# EAGLE design mini48U-v0.6.1 (EAGLE 5.11)
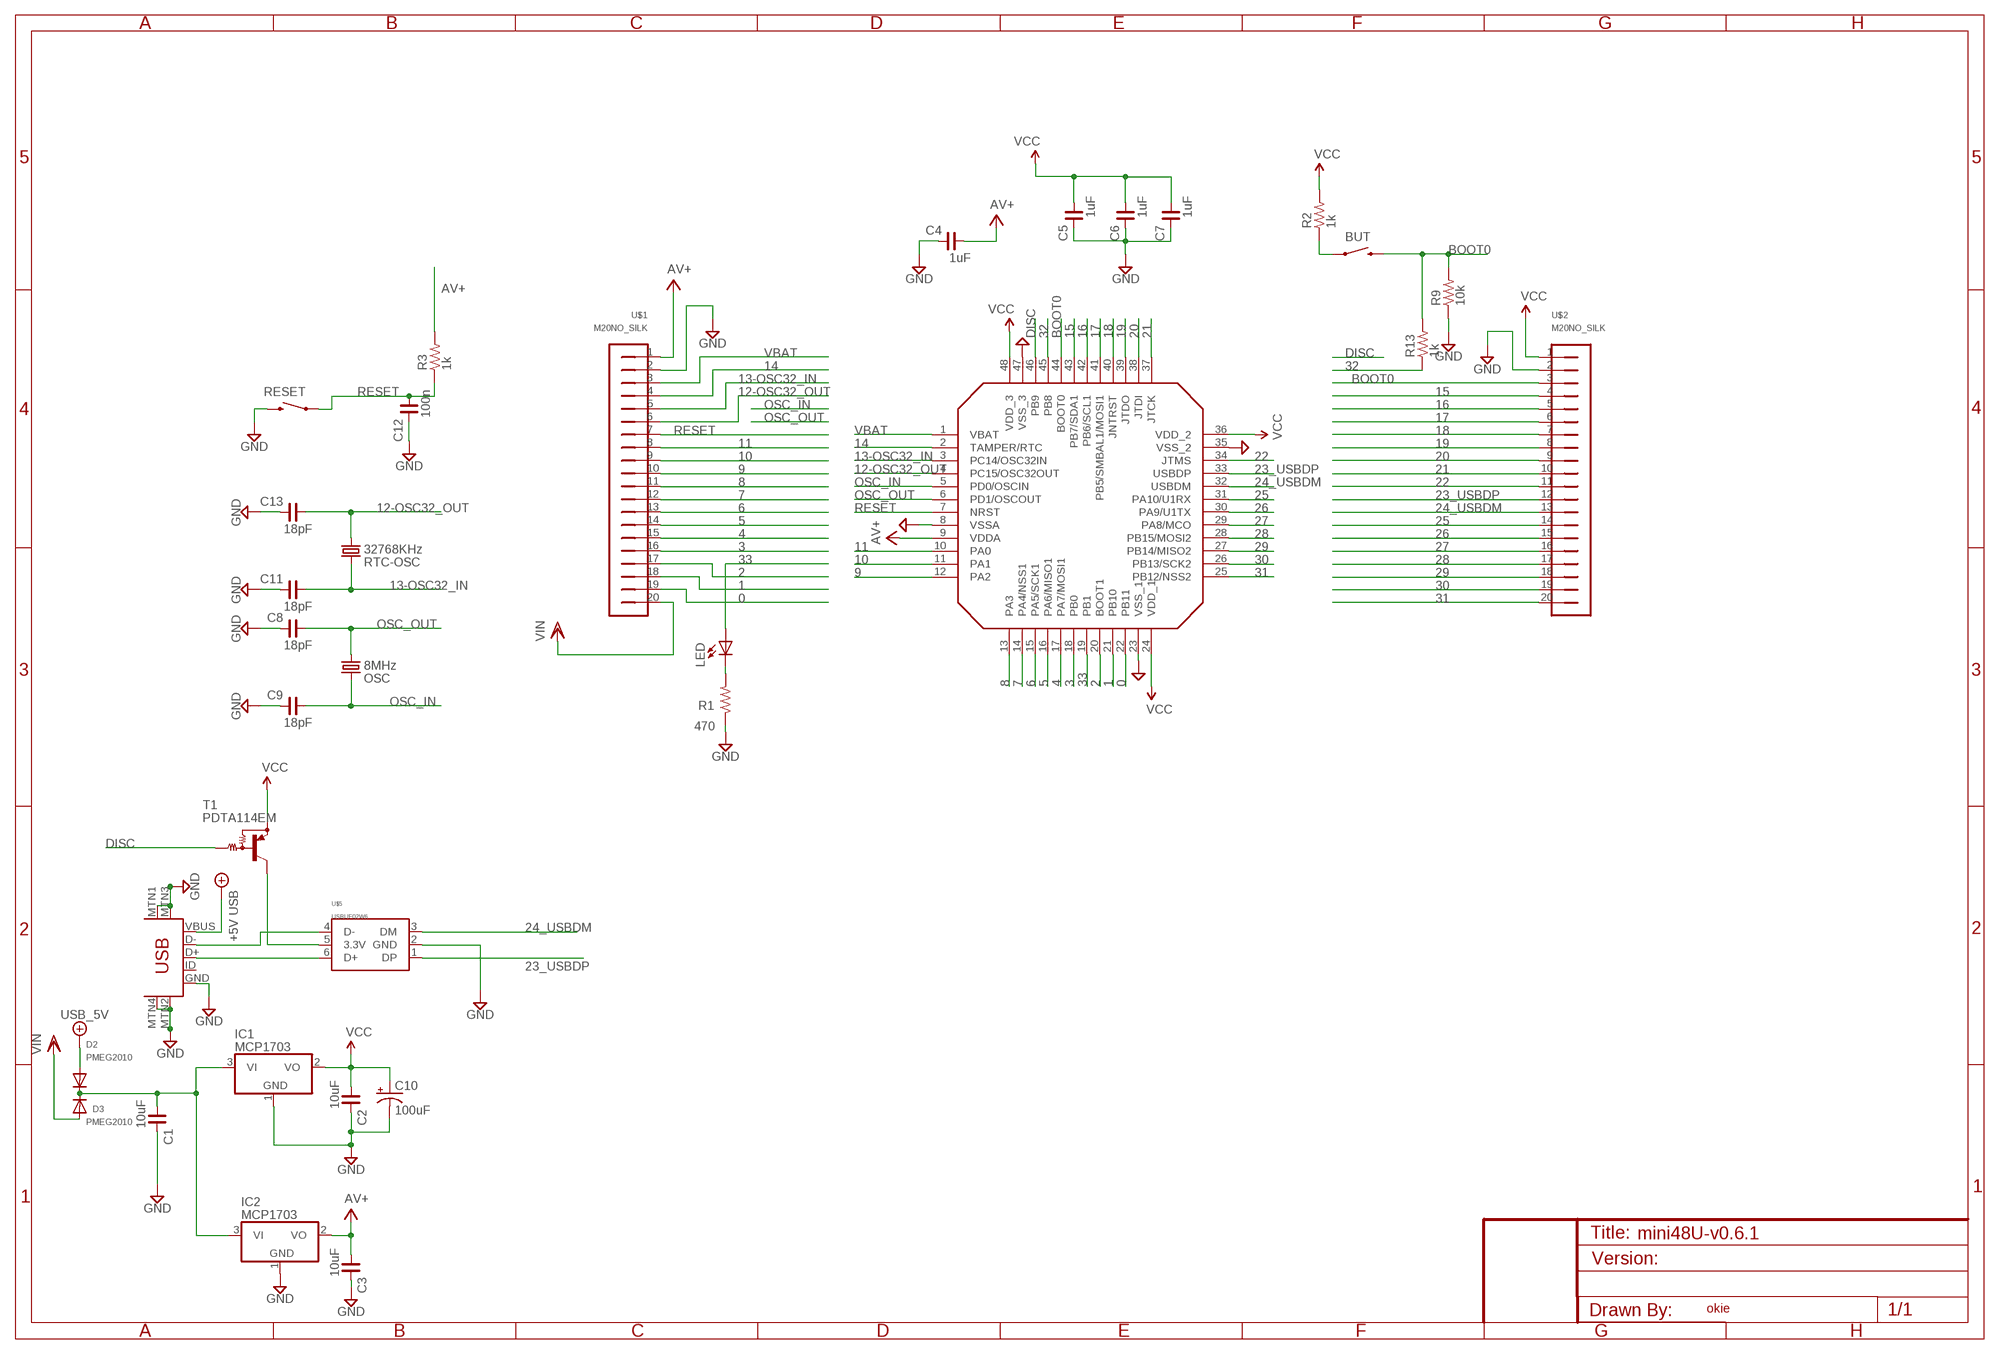
[diagram p0: schematic, sheet 1]

## Parts
BUT  SWITCH-MOMENTARY-2-SMD-1101NE  [TACTILE-SWITCH-1101NE]
C1  10uF  C_0805  [C0805]
C2  10uF  C_0805  [C0805]
C3  10uF  C_0805  [C0805]
C4  1uF  C_0402  [C0402]
C5  1uF  C_0402  [C0402]
C6  1uF  C_0402  [C0402]
C7  1uF  C_0402  [C0402]
C8  18pF  C_0402  [C0402]
C9  18pF  C_0402  [C0402]
C10  100uF  CAP_POL3528  [EIA3528]
C11  18pF  C_0402  [C0402]
C12  100n  C_0402  [C0402]
C13  18pF  C_0402  [C0402]
D2  PMEG2010  DIODESOD-323  [SOD-323]
D3  PMEG2010  DIODESOD-323  [SOD-323]
IC1  MCP1703  [SOT23-3]
IC2  MCP1703  [SOT23-3]
LED  LED  LEDKA-3528ASYC  [KA-3528ASYC]
OSC  8MHz  CRYSTALTC38H  [TC38H]
R1  470  R_0402  [R0402]
R2  1k  R_0402  [R0402]
R3  1k  R_0402  [R0402]
R9  10k  R_0402  [R0402]
R13  1k  R_0402  [R0402]
RESET  SWITCH-MOMENTARY-2-SMD-1101NE  [TACTILE-SWITCH-1101NE]
RTC-OSC  32768KHz  CRYSTALTC26H  [TC26H]
T1  PDTA114EM  PNP-DRIVERSOT723  [SOT-723]
U$1  M20NO_SILK  [1X20_NO_SILK]
U$2  M20NO_SILK  [1X20_NO_SILK]
U$4  STM32F103_48  [LQFP48-7X7]
U$5  USBUF02W6  [SC70-6]
USB  USB-MINIB-5PIN  [USB-MINIB]

## Nets
0: U$1.19 U$4.22(PB11)
1: U$1.18 U$4.21(PB10)
2: U$1.17 U$4.20(BOOT1)
3: U$1.16 U$4.18(PB0)
4: U$1.15 U$4.17(PA7/MOSI1)
5: U$1.14 U$4.16(PA6/MISO1)
6: U$1.13 U$4.15(PA5/SCK1)
7: U$1.12 U$4.14(PA4/NSS1)
8: U$1.11 U$4.13(PA3)
9: U$1.10 U$4.12(PA2)
10: U$1.9 U$4.11(PA1)
11: U$1.8 U$4.10(PA0)
12-OSC32_OUT: C13.1 RTC-OSC.1 U$1.6 U$4.4(PC15/OSC32OUT)
13-OSC32_IN: C11.1 RTC-OSC.2 U$1.5 U$4.3(PC14/OSC32IN)
14: U$1.4 U$4.2(TAMPER/RTC)
15: U$2.4 U$4.43(PB7/SDA1)
16: U$2.5 U$4.42(PB6/SCL1)
17: U$2.6 U$4.41(PB5/SMBAL1/MOSI1)
18: U$2.7 U$4.40(JNTRST)
19: U$2.8 U$4.39(JTDO)
20: U$2.9 U$4.38(JTDI)
21: U$2.10 U$4.37(JTCK)
22: U$2.11 U$4.34(JTMS)
23_USBDP: U$2.12 U$4.33(USBDP) U$5.1(DP)
24_USBDM: U$2.13 U$4.32(USBDM) U$5.3(DM)
25: U$2.14 U$4.31(PA10/U1RX)
26: U$2.15 U$4.30(PA9/U1TX)
27: U$2.16 U$4.29(PA8/MCO)
28: U$2.17 U$4.28(PB15/MOSI2)
29: U$2.18 U$4.27(PB14/MISO2)
30: U$2.19 U$4.26(PB13/SCK2)
31: U$2.20 U$4.25(PB12/NSS2)
32: R13.1 U$4.45(PB8)
33: LED.A U$4.19(PB1)
+5V/2 [vcc]: D2.A USB.VBUS ; supply symbol labelled USB_5V, +5V USB
AV+ [vcc]: C3.1 C4.1 IC2.2(VO) R3.2 U$1.1 U$4.9(VDDA)
BOOT0: BUT.P$2 R9.2 R13.2 U$2.3 U$4.44(BOOT0)
DGND: C1.2 C2.2 C3.2 C4.2 C5.2 C6.2 C7.2 C8.2 C9.2 C10.C(-) C11.2 C12.2 C13.2 IC1.1(GND) IC2.1(GND) R1.1 R9.1 RESET.P$2 U$1.2 U$2.2 U$4.8(VSSA) U$4.23(VSS_1) U$4.35(VSS_2) U$4.47(VSS_3) U$5.2(GND) USB.GND USB.MTN1(MTN2) USB.MTN2(MTN3) USB.MTN3(MTN1) USB.MTN4 ; supply symbol labelled GND
DISC: T1.1(B) U$4.46(PB9)
N$1: BUT.P$1 R2.1
N$2: LED.C R1.2
N$5 [vcc]: C1.1 D2.C D3.C IC1.3(VI) IC2.3(VI)
N$6: T1.3(C) U$5.5(3.3V)
N$14: U$5.4(D-) USB.D-
N$17: U$5.6(D+) USB.D+
OSC_IN: C9.1 OSC.2 U$4.5(PD0/OSCIN)
OSC_OUT: C8.1 OSC.1 U$4.6(PD1/OSCOUT)
RESET: C12.1 R3.1 RESET.P$1 U$1.7 U$4.7(NRST)
VBAT: U$1.3 U$4.1(VBAT)
VCC [vcc]: C2.1 C5.1 C6.1 C7.1 C10.A(+) IC1.2(VO) R2.2 T1.2(E) U$2.1 U$4.24(VDD_1) U$4.36(VDD_2) U$4.48(VDD_3)
VIN [vcc]: D3.A U$1.20
Unconnected: USB.ID

## Notes on the sheet
- BOOT0
- okie

## Library data of the parts
BUT RESET = SparkFun_20110922_my:SWITCH-MOMENTARY-2
C1-C9 C11-C13 = rc-master-smd:C_: NON-POLARIZED CAP
C10 = es:CAP_POL: Capacitor Polarized These are standard SMD and PTH capacitors. Normally 10uF, 47uF, and 100uF in electrolytic and tantalum varieties. Always verify the external diameter of the through hole cap, it varies with capacity, voltage, and manufacturer. The EIA devices should be standard.
D2 D3 = es:DIODE: Diode SMADIODE - SMA Surface Mount Package 20V 1A Schottky Diode Digikey: 641-1014-6-ND DO-1N4148 - Through Hole Small Current Diode SOD-123 20V 1 A (.5mV Vf) Schottky Diode - Digikey: MBRX120TPMSCT-ND SOD-323 10V 570mA (.38mV Vf, 3ns) Schottky Diode - Digikey: ZLLS410CT-ND SOD-523 30V 30mA Schottky Diode (RB751S-40TE61) - Digikey: RB751S-40TE61CT-ND SOT23-R/W - SOT23 Package (R = Solder Paste/Reflow Ovens, W = Hand-Soldering) BAT54Film 40V 300mA - Digikey: 497-7162-1-ND
IC1 IC2 = es:MCP1703: 250 mA, 16V, Low Quiescent Current LDO Regulator Source: http://ww1.microchip.com/downloads/en/DeviceDoc/22049b.pdf
LED = led:LED: LED OSRAM: - CHIPLED LG R971, LG N971, LY N971, LG Q971, LY Q971, LO R971, LY R971 LH N974, LH R974 LS Q976, LO Q976, LY Q976 LO Q996 - Hyper CHIPLED LW Q18S LB Q993, LB Q99A, LB R99A - SideLED LS A670, LO A670, LY A670, LG A670, LP A670 LB A673, LV A673, LT A673, LW A673 LH A674 LY A675 LS A676, LA A676, LO A676, LY A676, LW A676 LS A679, LY A679, LG A679 - Hyper Micro SIDELED® LS Y876, LA Y876, LO Y876, LY Y876 LT Y87S - SmartLED LW L88C, LW L88S LB L89C, LB L89S, LG L890 LS L89K, LO L89K, LY L89K LS L896, LA L896, LO L896, LY L896 - TOPLED LS T670, LO T670, LY T670, LG T670, LP T670 LSG T670, LSP T670, LSY T670, LOP T670, LYG T670 LG T671, LOG T671, LSG T671 LB T673, LV T673, LT T673, LW T673 LH T674 LS T676, LA T676, LO T676, LY T676, LB T676, LH T676, LSB T676, LW T676 LB T67C, LV T67C, LT T67C, LS T67K, LO T67K, LY T67K, LW E67C LS E67B, LA E67B, LO E67B, LY E67B, LB E67C, LV E67C, LT E67C LW T67C LS T679, LY T679, LG T679 LS T770, LO T770, LY T770, LG T770, LP T770 LB T773, LV T773, LT T773, LW T773 LH T774 LS E675, LA E675, LY E675, LS T675 LS T776, LA T776, LO T776, LY T776, LB T776 LHGB T686 LT T68C, LB T68C - Hyper Mini TOPLED® LB M676 - Mini TOPLED Santana® LG M470 LS M47K, LO M47K, LY M47K Source: http://www.osram.convergy.de LUXEON: - LUMILED® LXK2-PW12-R00, LXK2-PW12-S00, LXK2-PW14-U00, LXK2-PW14-V00 LXK2-PM12-R00, LXK2-PM12-S00, LXK2-PM14-U00 LXK2-PE12-Q00, LXK2-PE12-R00, LXK2-PE12-S00, LXK2-PE14-T00, LXK2-PE14-U00 LXK2-PB12-K00, LXK2-PB12-L00, LXK2-PB12-M00, LXK2-PB14-N00, LXK2-PB14-P00, LXK2-PB14-Q00 LXK2-PR12-L00, LXK2-PR12-M00, LXK2-PR14-Q00, LXK2-PR14-R00 LXK2-PD12-Q00, LXK2-PD12-R00, LXK2-PD12-S00 LXK2-PH12-R00, LXK2-PH12-S00 LXK2-PL12-P00, LXK2-PL12-Q00, LXK2-PL12-R00 Source: www.luxeon.com KINGBRIGHT: KA-3528ASYC Source: www.kingbright.com
OSC RTC-OSC = SparkFun_20110922_my:CRYSTAL: Crystals Various standard crystals. Proven footprints. Spark Fun Electronics SKU : COM-00534
R1-R3 R9 R13 = rc-master-smd:R_: RESISTOR
T1 = es:PNP-DRIVER
U$1 U$2 = es:M20
U$4 = stm32_a:STM32F103_48
U$5 = es:USBUF
USB = SparkFun_20110922_my:USB-MINIB: Mini-USB "B" connector with 5th pin broken out. Created new symbol breaking out 5th "ID" pin in mini/micro USB connector spec. See: http://en.wikipedia.org/wiki/Mini_usb#Cables. Uses same footprint as 4-pin symbol. Also added pins to connect to mounting / shield pads if required (probably not generally needed as signals aren't shielded once they leave the connector).

## Net classes
1 vcc: width 0.25 mm

## Board
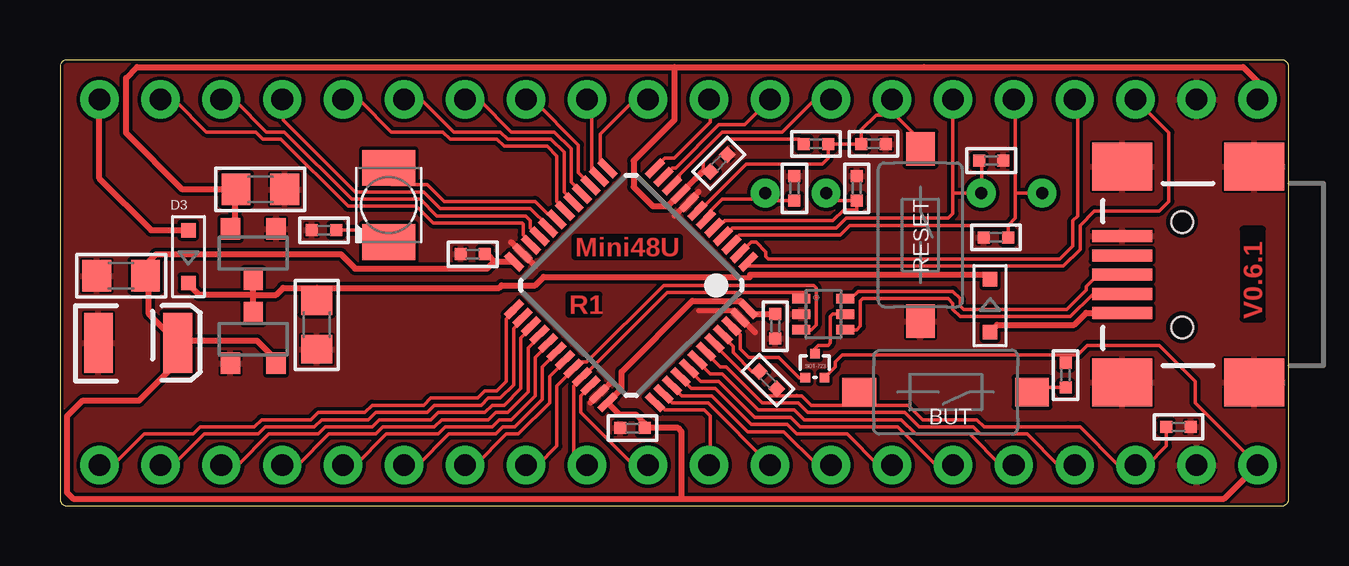
[diagram p1: board, top side]
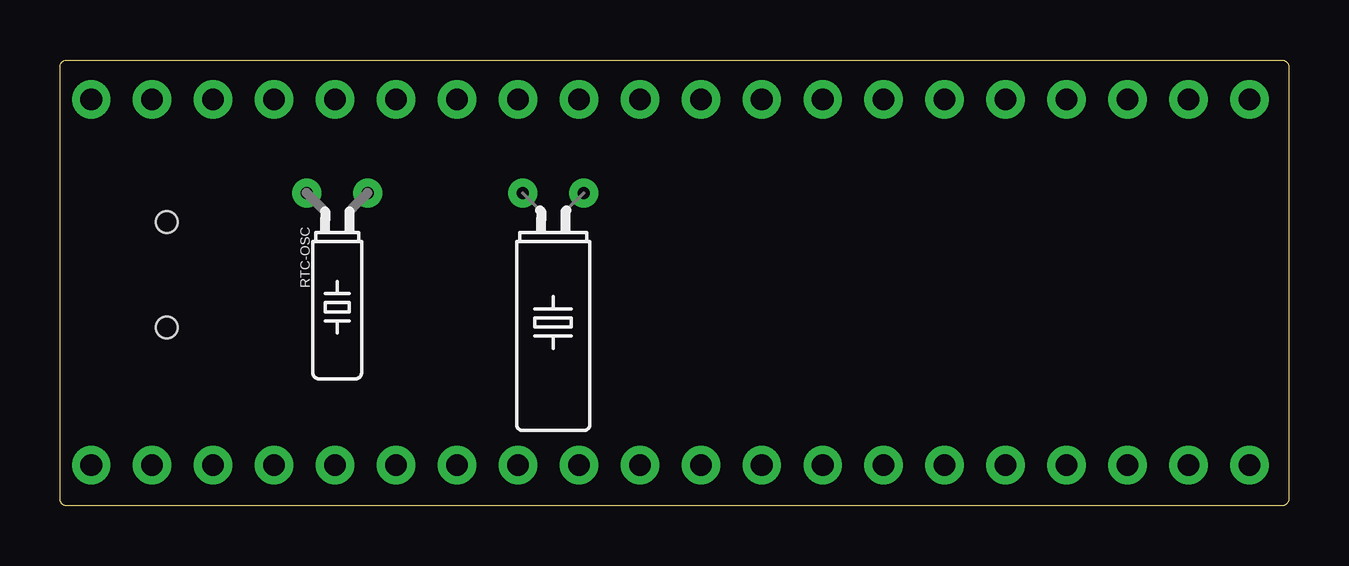
[diagram p2: board, bottom side, seen from below]

Size 51.2 x 18.6 mm. Coordinates in mm from the lower left corner, seen from the top.
Outline: 50.9,0 arc90 51.2,0.3 51.2,18.3 arc90 50.9,18.6 0.3,18.6 arc90 0,18.3 0,0.3 arc90 0.3,0 50.9,0
Copper layers (1*16): Top 0.018mm / dielectric 1.5mm / Bottom 0.018mm
Design rules "es-015mm *": minimum track width 0.125mm, minimum drill 0.4mm, track to track 0.15mm, track to pad 0.15mm, pad to pad 0.15mm, via to via 0.15mm, smd to smd 0.15mm, copper to edge 0.12mm, drill to drill 0.15mm, minimum pad ring 0.35mm, minimum via ring 0.35mm, stop-mask expansion 0mil, vias tented up to drill 25mil, thermal gap 0.09mm
tRestrict: 1 lines

### Footprints (pad centres in the part's own frame; a part is rotated, then mirrored left to right if it is on the bottom)
TACTILE-SWITCH-1101NE = smd 1.4 x 1.2: P$1 -3.6,0; P$2 3.6,0
C0805 = smd 1.2 x 1.3: 1 -1.016,0; 2 1.016,0
C0402 = smd 0.5 x 0.5: 1 -0.508,0; 2 0.508,0
EIA3528 = smd 1.2 x 2.5: A 1.65,0; C -1.65,0
SOD-323 = smd 0.6 x 0.6: A 1.1,0; C -1.1,0
SOT23-3 = smd 0.8 x 0.9: 1 -0.95,-1; 2 0.95,-1; 3 0,1.1
KA-3528ASYC = smd 1.5 x 2.2: A -1.55,0; C 1.55,0
TC38H = drill 0.5 round: 1 -1.27,0; 2 1.27,0
R0402 = smd 0.5 x 0.5: 1 -0.508,0; 2 0.508,0
TC26H = drill 0.5 round: 1 -1.27,0; 2 1.27,0
SOT-723 = smd 0.4 x 0.4: 1 -0.4,-0.6; 2 0.4,-0.6; 3 0,0.4
1X20_NO_SILK = drill 0.9 round: 1 0,0; 2 2.54,0; 3 5.08,0; 4 7.62,0; 5 10.16,0; 6 12.7,0; 7 15.24,0; 8 17.78,0; 9 20.32,0; 10 22.86,0; 11 25.4,0; 12 27.94,0; 13 30.48,0; 14 33.02,0; 15 35.56,0; 16 38.1,0; 17 40.64,0; 18 43.18,0; 19 45.72,0; 20 48.26,0
LQFP48-7X7 = smd 0.9 x 0.3: 1 -4.15,2.75; 2 -4.15,2.25; 3 -4.15,1.75; 4 -4.15,1.25; 5 -4.15,0.75; 6 -4.15,0.25; 7 -4.15,-0.25; 8 -4.15,-0.75; 9 -4.15,-1.25; 10 -4.15,-1.75; 11 -4.15,-2.25; 12 -4.15,-2.75; 25 4.15,-2.75; 26 4.15,-2.25; 27 4.15,-1.75; 28 4.15,-1.25; 29 4.15,-0.75; 30 4.15,-0.25; 31 4.15,0.25; 32 4.15,0.75; 33 4.15,1.25; 34 4.15,1.75; 35 4.15,2.25; 36 4.15,2.75 | smd 0.3 x 0.9: 13 -2.75,-4.15; 14 -2.25,-4.15; 15 -1.75,-4.15; 16 -1.25,-4.15; 17 -0.75,-4.15; 18 -0.25,-4.15; 19 0.25,-4.15; 20 0.75,-4.15; 21 1.25,-4.15; 22 1.75,-4.15; 23 2.25,-4.15; 24 2.75,-4.15; 37 2.75,4.15; 38 2.25,4.15; 39 1.75,4.15; 40 1.25,4.15; 41 0.75,4.15; 42 0.25,4.15; 43 -0.25,4.15; 44 -0.75,4.15; 45 -1.25,4.15; 46 -1.75,4.15; 47 -2.25,4.15; 48 -2.75,4.15
SC70-6 = smd 0.4 x 0.75: 1 -0.65,-0.925; 2 0,-0.925; 3 0.65,-0.925; 4 0.65,0.925; 5 0,0.925; 6 -0.65,0.925
USB-MINIB = smd 2.5 x 0.5: D+ 2.5,0; D- 2.5,0.8; GND 2.5,-1.6; ID 2.5,-0.8; VBUS 2.5,1.6 | smd 2.5 x 2: MTN1 -3,4.5; MTN2 2.5,4.5; MTN3 -3,-4.5; MTN4 2.5,-4.5 | hole 0.9: 0,2.2; 0,-2.2

### Placement (x,y rotation side)
BUT  36.9,4.75 180 top
C1  10.7,7.55 270 top
C2  2.55,9.6 180 top
C3  8.35,13.2 0 top
C4  27.45,14.3 45 top
C5  23.85,3.25 180 top
C6  17.2,10.5 180 top
C7  29.8,7.5 270 top
C8  30.6,13.25 90 top
C9  33.2,13.25 90 top
C10  3.25,6.8 0 top
C11  39,11.2 180 top
C12  33.9,15.1 0 top
C13  38.8,14.4 0 top
D2  38.75,8.35 270 top
D3  5.35,10.4 90 top
IC1  8.05,6.95 0 top
IC2  8.05,10.55 180 top
LED  13.7,12.55 270 top
OSC  30.65,13.05 180 bottom
R1  11,11.5 0 top
R2  41.9,5.45 90 top
R3  31.5,15.1 180 top
R9  46.6,3.3 180 top
R13  29.5,5.25 315 top
RESET  35.85,11.3 270 top
RTC-OSC  39.65,13.05 180 bottom
T1  31.45,5.95 0 top
U$1  49.9,16.95 180 top
U$2  49.9,1.7 180 top
U$4  23.8,9.2 225 top
U$5  31.8,8 270 top
USB  46.75,9.65 180 top

### Tracks (layer width: path | path; a pad name or v marks a point on that pad's centre or on a via)
0
  Top 0.15: U$4.22 19.63,10.97 19.3,11.3 19.3,11.75 19.25,11.8 15.55,11.8 14.85,12.5 12,12.5 9.2,15.3 8.45,15.3 8.15,15.6 6.1,15.6 4.8,16.9 4.23,16.9 U$1.19
1
  Top 0.15: U$4.21 19.95,11.25 19.6,11.6 19.6,11.9 19.4,12.1 15.7,12.1 15,12.8 12.15,12.8 9.35,15.6 8.6,15.6 7.3,16.9 6.77,16.9 U$1.18
2
  Top 0.15: U$4.20 20.34,11.67 19.6,12.4 15.85,12.4 15.15,13.1 12.3,13.1 9.3,16.1 9.3,16.91 U$1.17
3
  Top 0.15: U$4.18 21.04,12.36 20.7,12.7 20.7,14.6 20.3,15 18.5,15 18.2,15.3 16.25,15.3 15.95,15.6 13.8,15.6 12.5,16.9 11.85,16.9 U$1.16
4
  Top 0.15: U$4.17 21.4,12.7 21,13.1 21,14.75 20.45,15.3 18.65,15.3 18.35,15.6 16.4,15.6 15.1,16.9 14.39,16.9 U$1.15
5
  Top 0.15: U$4.16 21.75,13.05 21.3,13.5 21.3,14.9 20.6,15.6 18.8,15.6 17.5,16.9 16.93,16.9 U$1.14
6
  Top 0.15: U$4.15 22.1,13.4 21.6,13.9 21.6,15.05 19.75,16.9 19.47,16.9 U$1.13
7
  Top 0.15: U$4.14 22.46,13.74 22.15,14.05 22.15,16.95 U$1.12
8
  Top 0.15: U$4.13 22.5,14.4 22.5,15.5 23.9,16.9 24.45,16.9 U$1.11
9
  Top 0.15: U$4.12 25.2,14.5 25.6,14.5 27.1,16 27.1,16.89 U$1.10
10
  Top 0.15: U$4.11 25.14,13.74 25.5,14.1 25.65,14.1 27.45,15.9 28.53,15.9 U$1.9
11
  Top 0.15: U$1.8 32.07,17 31.5,17 30.1,15.6 27.6,15.6 25.8,13.8 25.8,13.7 25.5,13.4 U$4.10
12-OSC32_OUT
  Top 0.15: U$4.4 27.65,11.25 28,11.6 29.9,11.6 32.35,11.6 32.75,12 37,12 37.2,12.2 37.2,13 | 37.2,13 U$1.6 | 37.2,13 37.25,13.05 RTC-OSC.1 38.4,13.07 38.4,14.3 38.39,14.3 C13.1
13-OSC32_IN
  Top 0.15: U$4.3 27.97,10.97 28.3,11.3 32.5,11.3 32.9,11.7 39.5,11.7 | U$1.5 39.8,16.9 39.8,13 | 39.8,13 39.8,12 39.5,11.7 | RTC-OSC.2 39.85,13.05 39.8,13 | C11.1 39.51,11.69 39.5,11.7
14
  Top 0.15: U$4.2 28.34,10.54 28.8,11 29,11 29.4,10.6 29.4,10.4 29.5,10.3 41.65,10.3 42.2,10.85 42.2,11.9 42.4,12.1 42.4,16.83 U$1.4
15
  Top 0.15: U$4.43 26.86,6.44 27.5,5.8 27.75,5.8 29.25,4.3 30.75,4.3 31.15,3.9 35.2,3.9 35.8,3.3 38.05,3.3 38.35,3 40.3,3 41.6,1.7 U$2.4 42.2,1.78
16
  Top 0.15: U$4.42 26.51,6.09 27.1,5.5 27.6,5.5 29.1,4 30.6,4 31,3.6 35.05,3.6 35.65,3 37.9,3 39.2,1.7 U$2.5
17
  Top 0.15: U$4.41 26.16,5.73 26.7,5.2 27.45,5.2 28.95,3.7 30.45,3.7 30.85,3.3 34.9,3.3 36.5,1.7 U$2.6
18
  Top 0.15: U$4.40 25.82,5.38 26.3,4.9 27.3,4.9 28.8,3.4 30.3,3.4 30.7,3 32.8,3 34.1,1.7 U$2.7
19
  Top 0.15: U$4.39 25.47,5.03 25.9,4.6 27.15,4.6 28.65,3.1 30.15,3.1 31.5,1.75 32.07,1.75 U$2.8
20
  Top 0.15: U$4.38 25.14,4.66 25.5,4.3 27,4.3 29.6,1.7 29.6,1.72 U$2.9
21
  Top 0.15: U$4.37 24.88,4.32 25.2,4 26.85,4 27.1,3.75 27.1,1.76 U$2.10
22
  Top 0.15: U$4.34 22.1,5 21.7,4.6 21.7,3.9 23.9,1.7 U$2.11
23_USBDP
  Top 0.15: U$2.12 21.5,1.7 21.4,1.8 21.4,5 21.75,5.35 U$4.33 21.78,5.38 25.3,8.9 31.1,8.9 31.1,8.8 30.95,8.65 U$5.1
24_USBDM
  Top 0.15: U$2.13 19.9,1.7 20.7,2.5 20.7,5 21.4,5.7 U$4.32 21.43,5.73 21.7,6 21.95,6 25.15,9.2 31.4,9.2 31.5,9.1 31.5,7.55 31.3,7.35 U$5.3
25
  Top 0.15: U$4.31 21.04,6.04 20.4,5.4 20.4,4.3 19.1,3 18.6,3 17.3,1.7 U$2.14
26
  Top 0.15: U$4.30 20.69,6.39 20.1,5.8 20.1,4.45 18.95,3.3 18.45,3.3 18.15,3 16.2,3 14.9,1.7 U$2.15
27
  Top 0.15: U$4.29 20.34,6.74 19.8,6.2 19.8,4.6 18.8,3.6 18.3,3.6 18,3.3 16.05,3.3 15.75,3 13.6,3 12.3,1.7 U$2.16
28
  Top 0.15: U$4.28 19.98,7.08 19.5,6.6 19.5,4.75 18.65,3.9 18.15,3.9 17.85,3.6 15.9,3.6 15.6,3.3 13.45,3.3 13.15,3 11.2,3 9.9,1.7 U$2.17
29
  Top 0.15: U$4.27 19.63,7.43 19.2,7 19.2,4.9 18.5,4.2 18,4.2 17.7,3.9 15.75,3.9 15.45,3.6 13.3,3.6 13,3.3 11.05,3.3 10.75,3 8.7,3 7.4,1.7 U$2.18
30
  Top 0.15: U$4.26 19.27,7.77 18.9,7.4 18.9,5.05 18.35,4.5 17.85,4.5 17.55,4.2 15.6,4.2 15.3,3.9 13.15,3.9 12.85,3.6 10.9,3.6 10.6,3.3 8.55,3.3 8.25,3 6,3 4.7,1.7 U$2.19
31
  Top 0.15: U$4.25 18.92,8.12 18.6,7.8 18.6,5.2 18.2,4.8 17.7,4.8 17.4,4.5 15.45,4.5 15.15,4.2 13,4.2 12.7,3.9 10.75,3.9 10.45,3.6 8.4,3.6 8.1,3.3 5.85,3.3 5.55,3 3.5,3 2.2,1.7 U$2.20
32
  Top 0.15: U$4.45 27.62,7.08 28.05,6.65 28.05,6.4 28.85,5.6 R13.1
33
  Top 0.15: U$4.19 20.64,11.96 20.4,12.2 20.3,12.2 19.8,12.7 16,12.7 15.3,13.4 13.8,13.4 13.7,13.5 LED.A
+5V/2
  Top 0.25: USB.VBUS 42.75,8.05 42.25,7.55 39.05,7.55 D2.A
AV+
  Top 0.15: 26.82,13.99 26.82,14.01 26.8,14.03 26.8,14.35 27.75,15.3 30.79,15.3 R3.2
  Top 0.25: 25.6,18.3 25.6,16.1 23.9,14.4 23.9,13.3 24.7,12.5 25.33,12.5 U$4.9 26.47,13.63 26.72,13.88 | 25.6,18.3 36,18.3 49.3,18.3 49.9,17.7 U$1.1 | 26.72,13.88 26.82,13.99 | 7.3,13.2 7.3,11.75 IC2.2 | 7.3,13.2 7.3,13.6 | 7.3,13.2 C3.1 5.1,13.2 2.75,15.55 2.75,17.85 3.2,18.3 25.6,18.3 | C4.1 26.77,13.94 26.72,13.88
BOOT0
  Top 0.15: 29.85,4.6 29.4,4.6 27.9,6.1 27.27,6.74 U$4.44 | 29.85,4.6 30.7,4.6 | 30.7,4.6 30.9,4.6 31.3,4.2 33.3,4.2 | 33.3,4.2 35.35,4.2 35.95,3.6 36.2,3.6 38.2,3.6 38.5,3.3 42,3.3 42.5,3.3 44.1,1.7 U$2.3 45.3,1.7 46.1,2.5 R9.2 | 30.7,4.6 30.71,4.61 | R13.2 29.86,4.61 29.85,4.6 | 33.3,4.2 BUT.P$2
DGND
  Top 0.2: 26.6,8.15 28.05,8.15
  Top 0.25: 26.6,13.1 25.6,12.1 | 28.05,8.15 28.95,7.25 | 19.8,10 18.8,11 19.8,10 | 22.1,4.3 22.9,5.1 22.1,4.3
  pour Top: -0.8,21.8 -0.8,-2.9 51.6,-2.9 51.6,21.8
DISC
  Top 0.15: U$4.46 28,7.5 28.35,7.15 28.35,6.55 28.7,6.2 29.95,6.2 30.8,5.35 31,5.35 T1.1
N$1
  Top 0.15: R2.1 40.69,4.94 BUT.P$1
N$2
  Top 0.15: R1.2 13.2,11.5 LED.C
N$5
  Top 0.2: 28.15,9.55 28.15,9.53 28.75,9.53 28.75,9.65
  Top 0.25: 28.15,9.55 20.15,9.55 19.8,9.2 18.4,9.2 18.3,9.1 10.7,9.1 | 10.7,9.1 9.3,9.1 9,8.8 8.05,8.8 | 10.7,9.1 C1.1 | IC1.3 8.05,8.8 | 8.05,8.8 IC2.3 | 8.05,8.8 5.8,8.8 5.35,9.25 D3.C | 28.75,9.65 38.55,9.65 D2.C
N$6
  Top 0.15: U$5.5 32.2,8 32.1,7.9 32.1,6.8 32,6.7 31.6,6.7 31.45,6.55 T1.3
N$14
  Top 0.15: U$5.4 33.2,7.35 33.35,7.5 33.35,8.55 33.45,8.65 37,8.65 37.2,8.45 37.2,8.2 37.5,7.9 42.1,7.9 43,8.8 44.2,8.8 | 44.2,8.8 USB.D- 44.2,8.8
N$17
  Top 0.15: U$5.6 32.95,8.65 33.25,8.95 37.2,8.95 37.5,8.65 37.5,8.35 37.65,8.2 41.95,8.2 42.75,9 42.75,9.15 43.2,9.6 44.2,9.6 USB.D+
OSC_IN
  Top 0.15: U$4.5 27.3,11.6 27.55,11.85 27.65,11.85 27.7,11.9 32.2,11.9 32.65,12.35 33.2,12.35 C9.1 32.23,12.74 OSC.2
OSC_OUT
  Top 0.15: U$4.6 26.91,12.01 27.1,12.2 27.1,12.3 27.6,12.8 29.13,12.8 OSC.1 29.69,12.74 C8.1
RESET
  Top 0.15: U$4.7 26.56,12.21 28.6,14.25 31.75,14.25 32,14.5 R3.1 C12.1 33.39,15.69 34,16.3 34.6,16.3 34.7,16.4 | 34.7,16.4 34.7,16.91 U$1.7 | RESET.P$1 35.85,15.25 34.7,16.4
VBAT
  Top 0.15: U$4.1 28.68,10.02 28.7,10 41.8,10 42.5,10.7 42.5,11.7 43.1,12.3 45.8,12.3 46.2,12.7 46.2,15.57 U$1.3
VCC
  Top 0.15: U$2.1 47.3,4.3 47.3,5.2 45.8,6.7 42.8,6.7 42.4,6.3 41.9,6.3 | 41.9,6.3 32.6,6.3 32.3,6 32.3,5.8 T1.2 | 41.9,6.3 R2.2
  Top 0.25: 25.9,0.3 0.55,0.3 0.3,0.55 0.3,3.75 0.95,4.4 3.3,4.4 4.9,6 C10.A | 25.9,0.3 48.5,0.3 U$2.1 | IC1.2 9,6.1 8.2,6.9 4.9,6.9 C10.A | C7.1 28.88,8.01 U$4.48 28.6,8.29 28.6,8.3 28.35,8.55 26.35,8.55 23.4,5.6 23.4,4.9 22.8,4.3 U$4.36 23.33,3.8 24,3.8 24.35,3.45 24.36,3.44 C5.1 25.75,3.25 25.9,3.1 25.9,0.3 | 3.7,9.6 3.7,8 C10.A | 3.7,9.6 3.7,10.2 4,10.5 11.7,10.5 12.3,9.9 17.8,9.9 18.1,10.2 | 3.7,9.6 C2.1 | U$4.24 18.11,10.2 18.1,10.2 | C6.1 17.8,10.5 18.1,10.2
VIN
  Top 0.25: U$1.20 1.64,13.66 3.8,11.5 D3.A
(copper drawn outside any net)
  shapes: Top circle x2

### Text on the board
Top: Mini48U | R1 | V0.6.1
tValues: VIN | 0 | 1 | 2 | 3 | 4 | 5 | 6 | 7 | 8 | 9 | 10 | 11 | RESET | 12 | 13 | 14 | VBAT | GND | AV+ | 33 | 31 | 30 | 29 | 28 | 27 | 26 | 25 | 24 | 23 | 22 | 21 | 20 | 19 | 18 | 17 | 16 | 15 | BOOT0 | GND | +3.3V